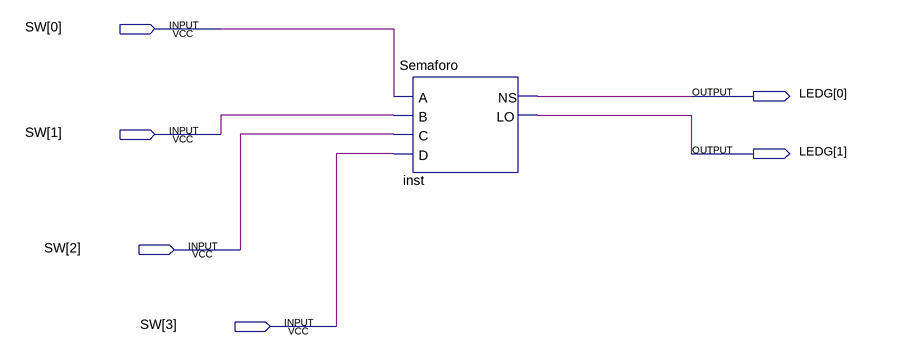
[diagram p0: schematic sheet]
// Quartus schematic Q4.bdf as structural Verilog: 1 symbols, 6 pins
module Q4 (
  input  [3:0] SW,
  output [1:0] LEDG
);

  Semaforo inst (.A(SW[0]), .B(SW[1]), .C(SW[2]), .D(SW[3]), .NS(LEDG[0]), .LO(LEDG[1]));
endmodule
